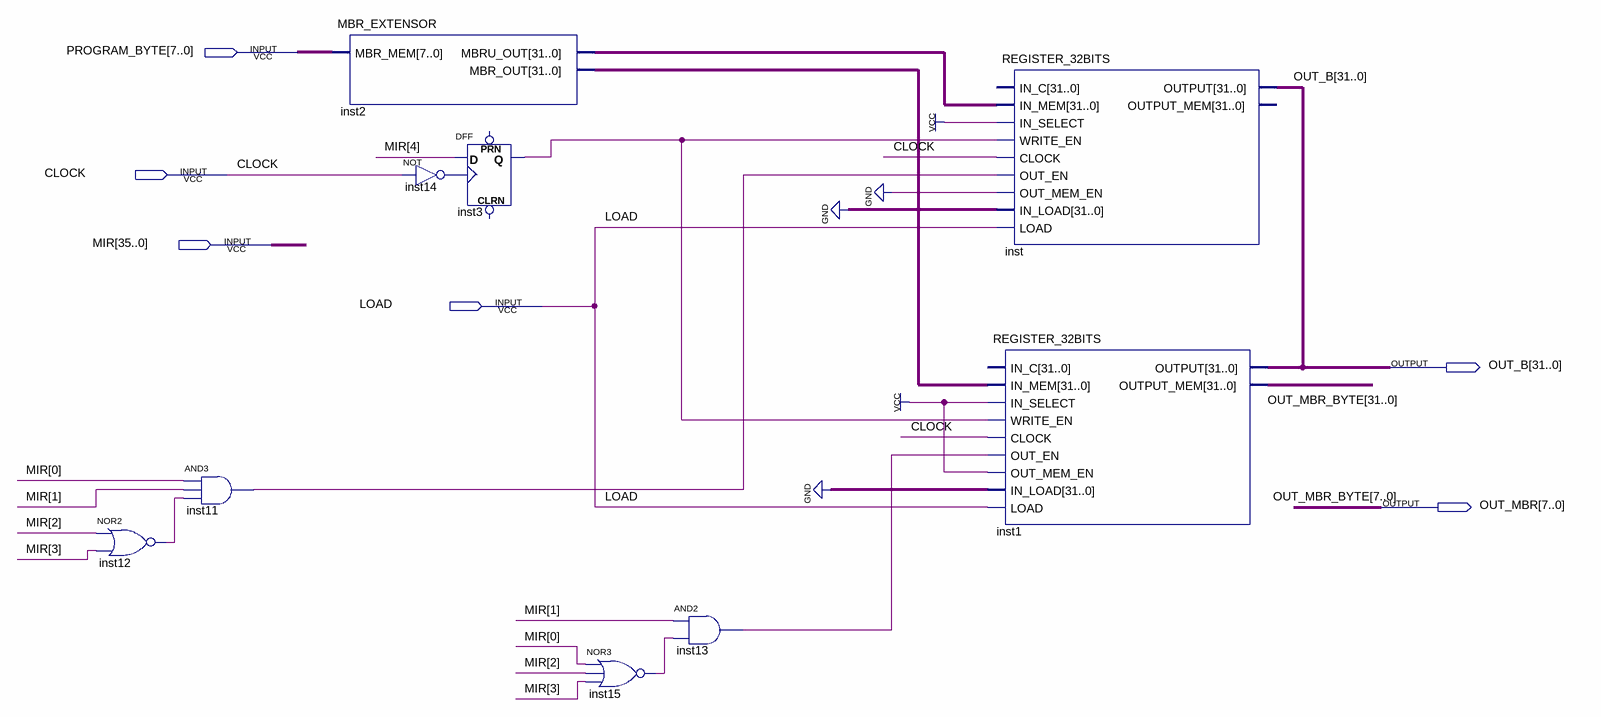
[diagram p0: schematic sheet]
// Quartus schematic MBR.bdf as structural Verilog: 9 symbols, 6 pins
module MBR (
  input  [7:0] PROGRAM_BYTE,
  input  CLOCK,
  input  [35:0] MIR,
  input  LOAD,
  output [31:0] OUT_B,
  output [7:0] OUT_MBR
);

  wire inst3_q, inst11_out, inst12_out, inst13_out, inst14_out, inst15_out;
  wire [31:0] inst2_mbr_out, inst2_mbru_out;
  wire [31:8] OUT_MBR_BYTE;

  nor inst12 (inst12_out, MIR[2], MIR[3]);
  and inst11 (inst11_out, MIR[0], MIR[1], inst12_out);
  MBR_EXTENSOR inst2 (.MBR_MEM(PROGRAM_BYTE), .MBRU_OUT(inst2_mbru_out), .MBR_OUT(inst2_mbr_out));
  not inst14 (inst14_out, CLOCK);
  DFF inst3 (.CLK(inst14_out), .D(MIR[4]), .Q(inst3_q));  // open: CLRN, PRN
  nor inst15 (inst15_out, MIR[0], MIR[2], MIR[3]);
  and inst13 (inst13_out, MIR[1], inst15_out);
  REGISTER_32BITS inst (
    .IN_MEM(inst2_mbru_out), .IN_SELECT(1'b1), .WRITE_EN(inst3_q), .CLOCK(CLOCK), .OUT_EN(inst11_out),
    .OUT_MEM_EN(1'b0), .IN_LOAD({32{1'b0}}), .LOAD(LOAD), .OUTPUT(OUT_B));  // open: IN_C, OUTPUT_MEM
  REGISTER_32BITS inst1 (
    .IN_MEM(inst2_mbr_out), .IN_SELECT(1'b1), .WRITE_EN(inst3_q), .CLOCK(CLOCK), .OUT_EN(inst13_out),
    .OUT_MEM_EN(1'b1), .IN_LOAD({32{1'b0}}), .LOAD(LOAD), .OUTPUT(OUT_B), .OUTPUT_MEM({OUT_MBR_BYTE, OUT_MBR}));  // open: IN_C

  // Other names for the same wires on the sheet: OUT_MBR_BYTE[7:0] = OUT_MBR
endmodule
